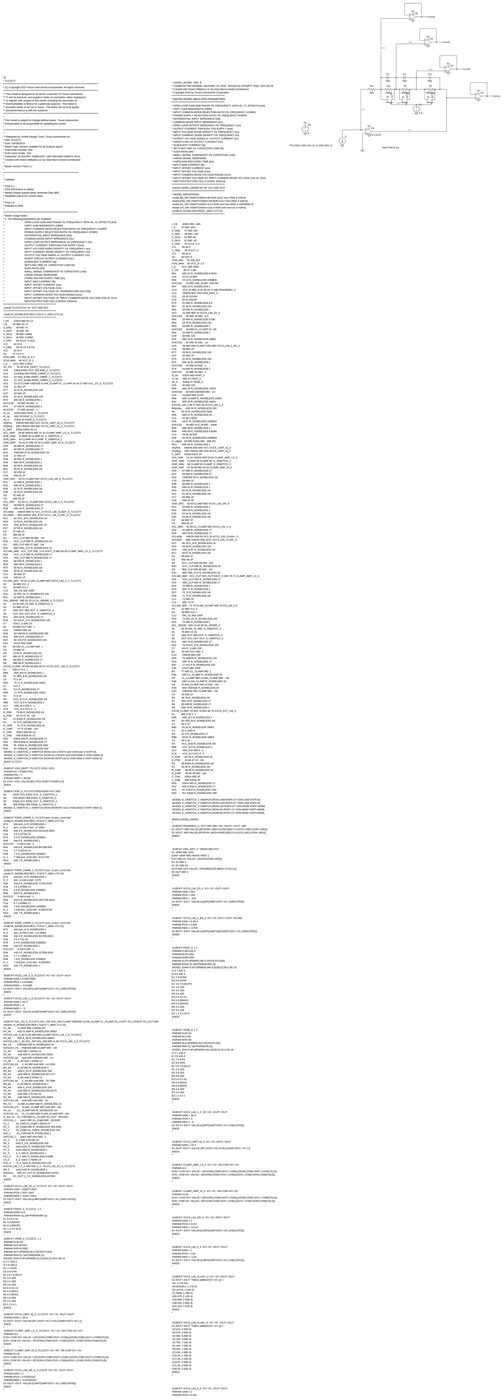
[diagram p0: schematic TIA base.asc, whole sheet]
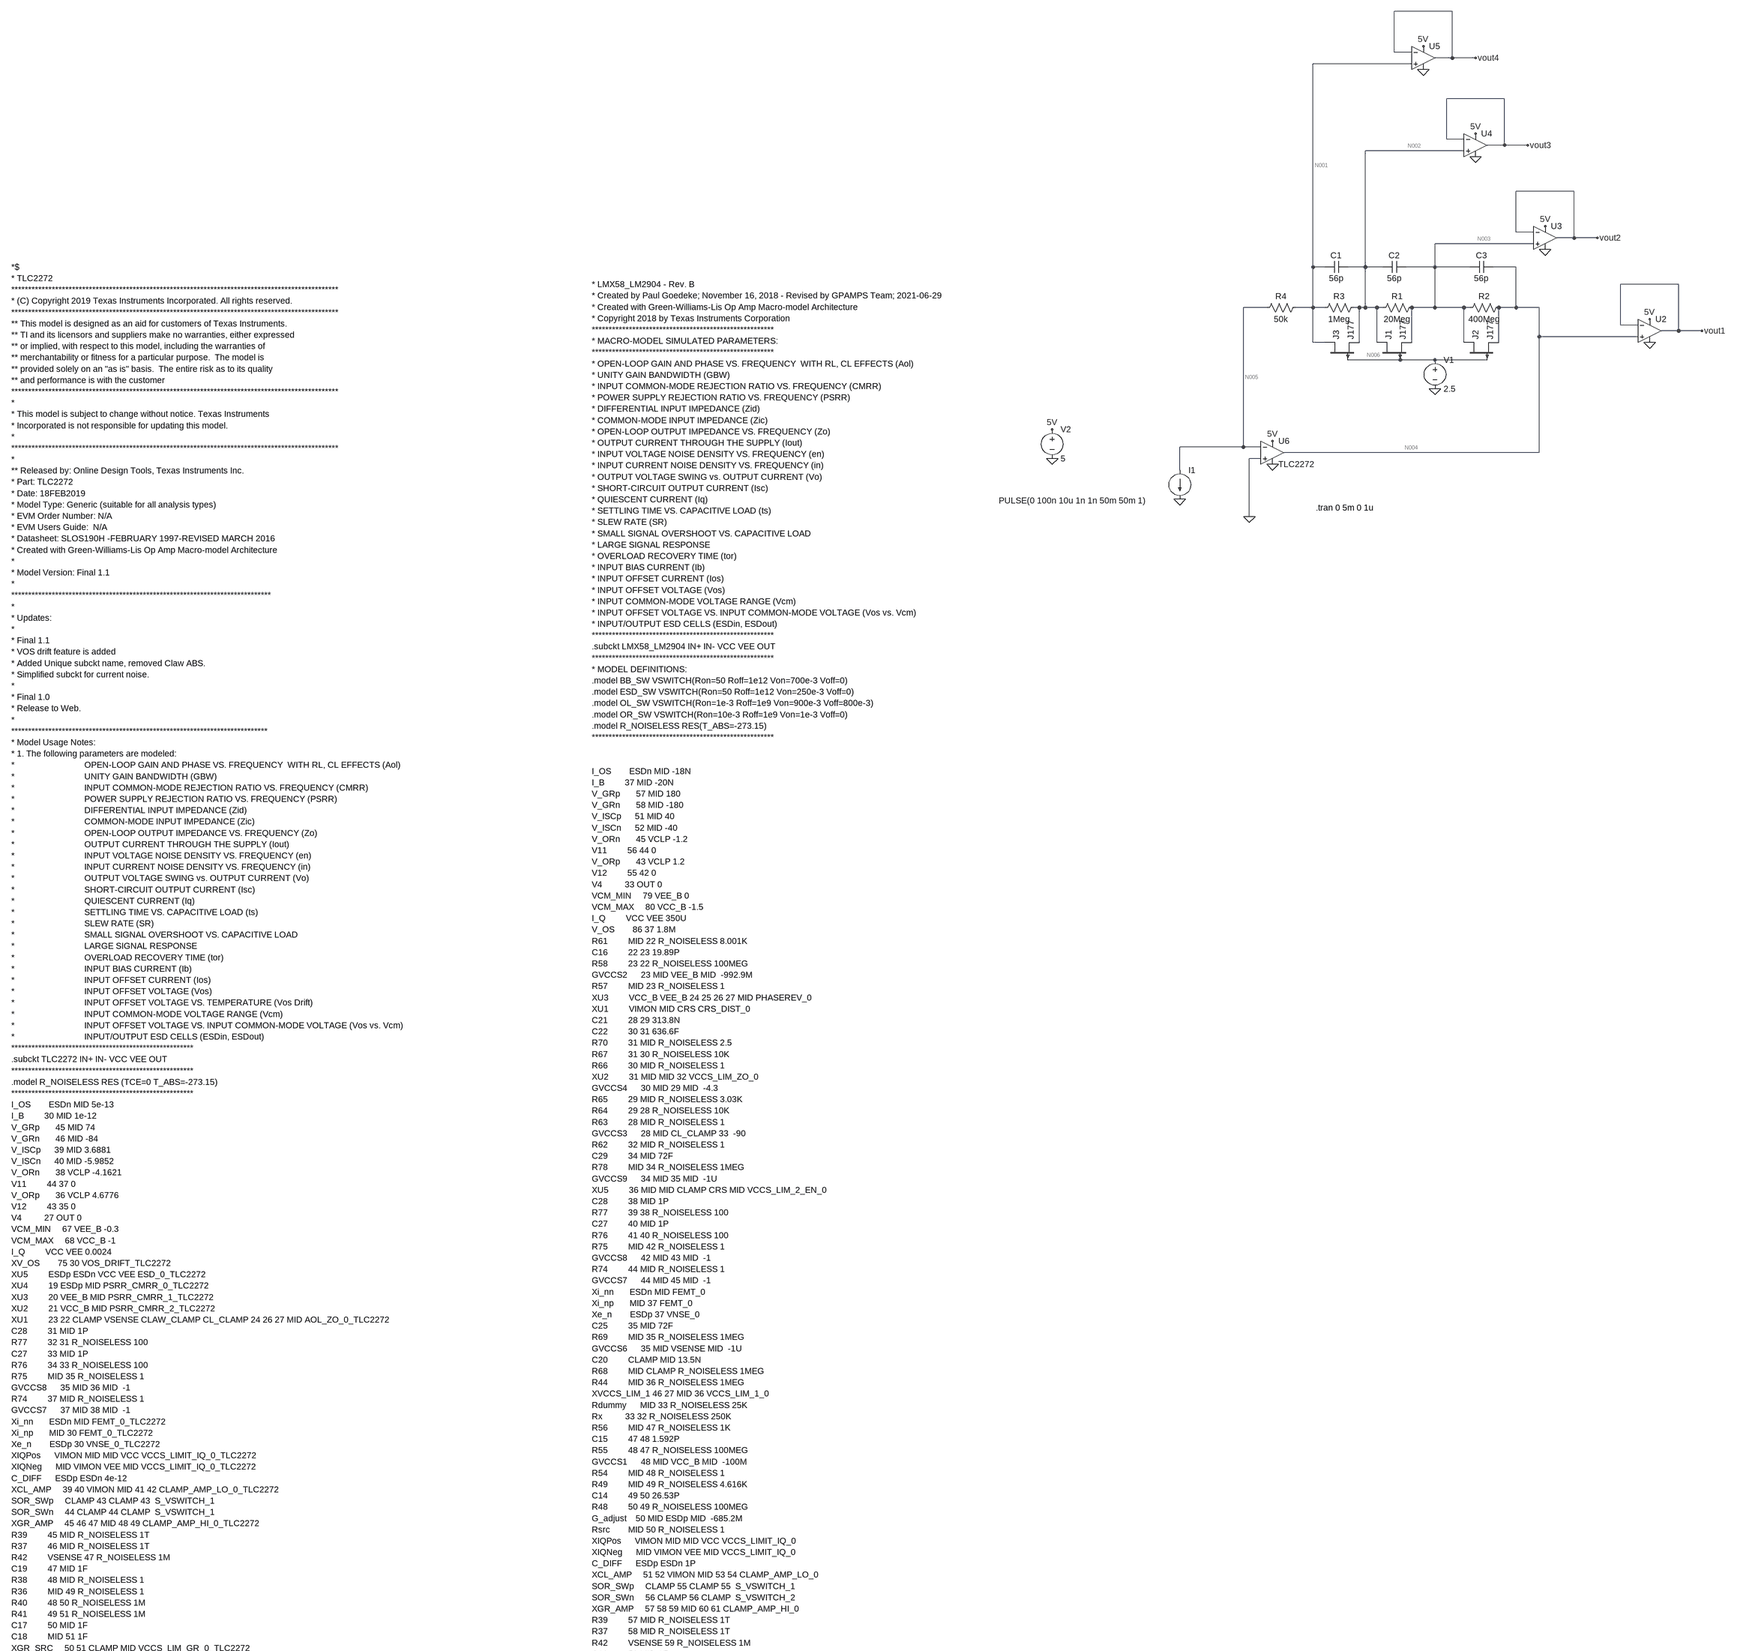
[diagram p1: schematic TIA base.asc, part, row 1 of 3, column 1 of 1]
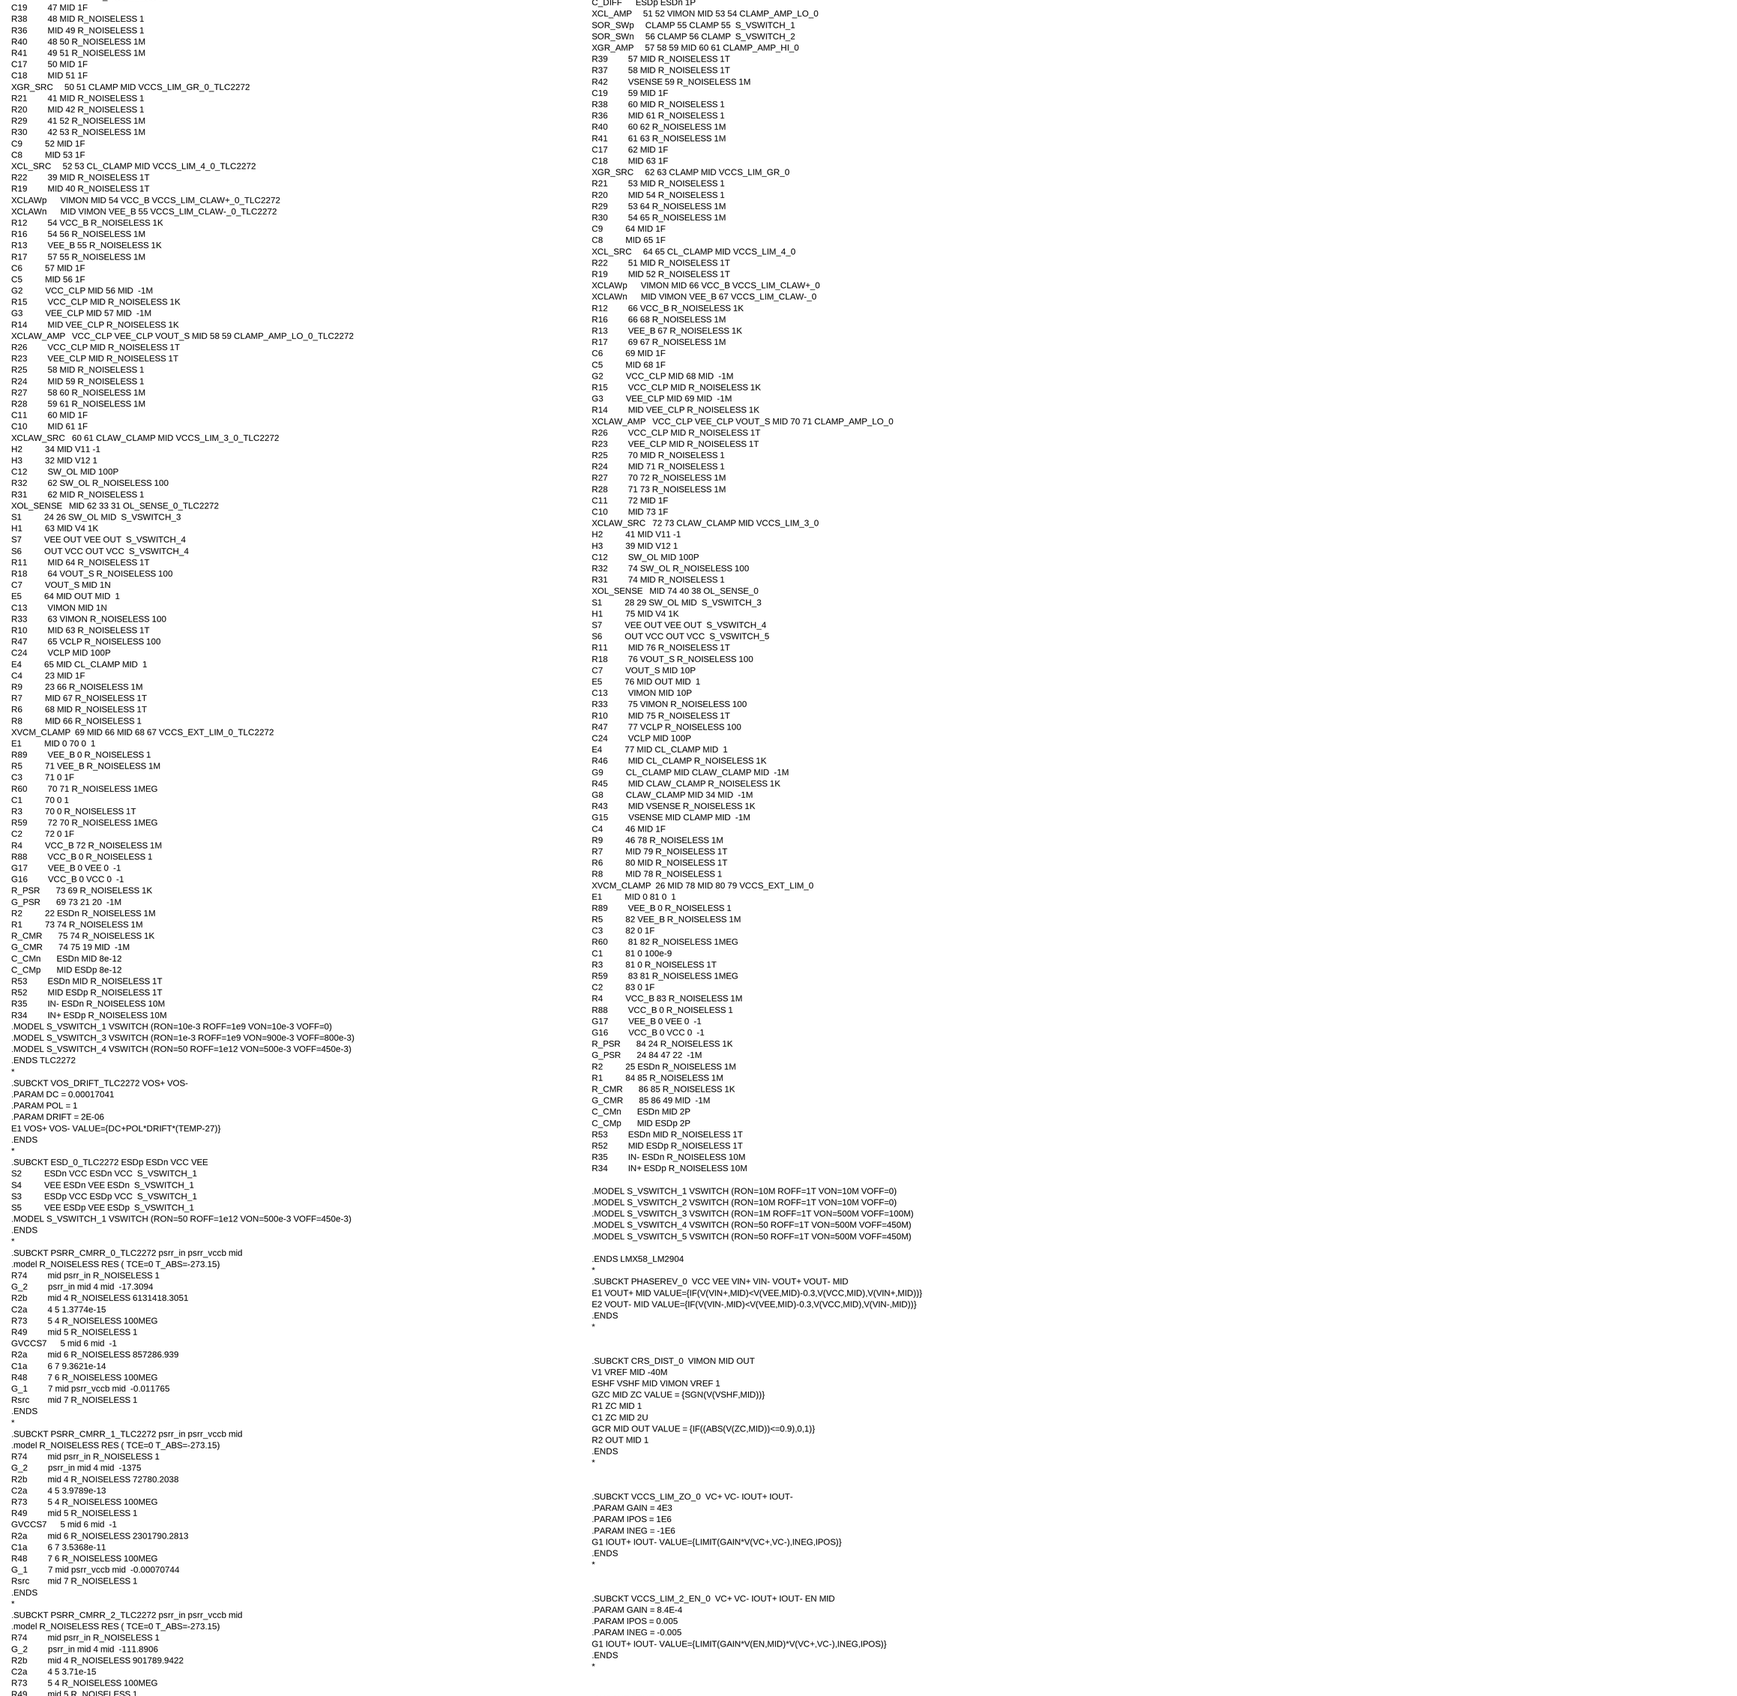
[diagram p2: schematic TIA base.asc, part, row 2 of 3, column 1 of 1]
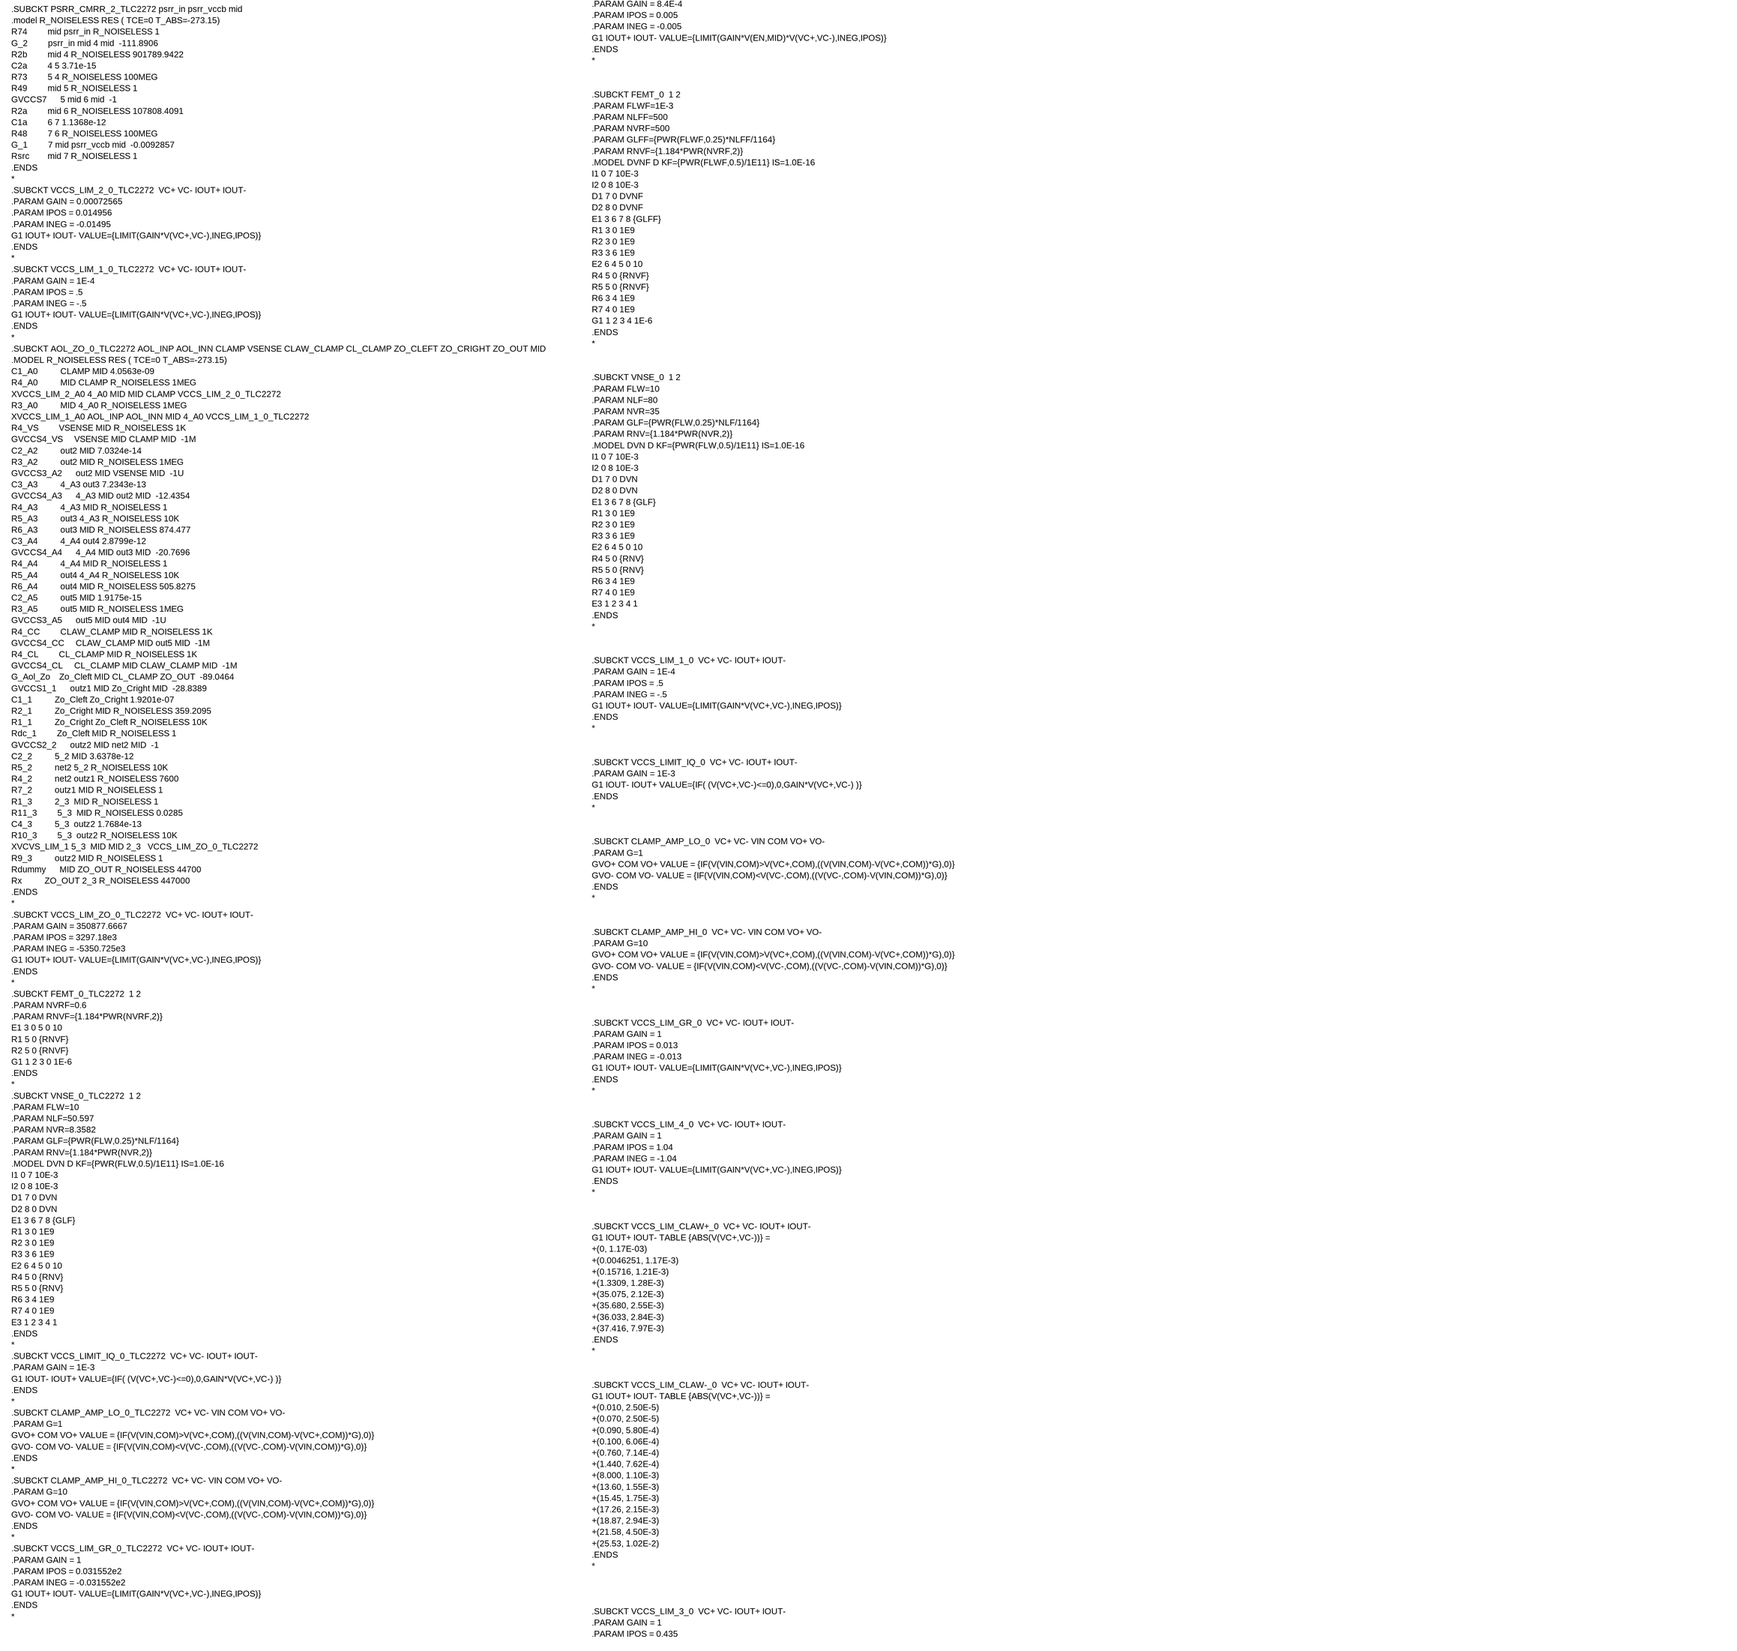
[diagram p3: schematic TIA base.asc, part, row 3 of 3, column 1 of 1]
* TIA base.asc
I1 N005 0 PULSE(0 100n 10u 1n 1n 50m 50m 1)
V2 5V 0 5
R1 N003 N002 20Meg
R2 N004 N003 400Meg
J1 N002 N006 N003 J177
J2 N003 N006 N004 J177
R3 N002 N001 1Meg
V1 N006 0 2.5
J3 N001 N006 N002 J177
R4 N001 N005 50k
X§U2 N004 vout1 5V 0 vout1 level1 Avol=1Meg GBW=10Meg Vos=0 En=0 Enk=0 In=0 Ink=0 Rin=5000Meg  ; pins In+ In- V+ V- OUT
X§U3 N003 vout2 5V 0 vout2 level1 Avol=1Meg GBW=10Meg Vos=0 En=0 Enk=0 In=0 Ink=0 Rin=5000Meg  ; pins In+ In- V+ V- OUT
X§U4 N002 vout3 5V 0 vout3 level1 Avol=1Meg GBW=10Meg Vos=0 En=0 Enk=0 In=0 Ink=0 Rin=5000Meg  ; pins In+ In- V+ V- OUT
X§U5 N001 vout4 5V 0 vout4 level1 Avol=1Meg GBW=10Meg Vos=0 En=0 Enk=0 In=0 Ink=0 Rin=500Meg  ; pins In+ In- V+ V- OUT
C1 N002 N001 56p
C2 N003 N002 56p
C3 N004 N003 56p
X§U6 0 N005 5V 0 N004 TLC2272  ; pins In+ In- V+ V- OUT
.model NJF NJF
.model PJF PJF
.lib standard.jft
* LMX58_LM2904 - Rev. B
* Created by Paul Goedeke; November 16, 2018 - Revised by GPAMPS Team; 2021-06-29
* Created with Green-Williams-Lis Op Amp Macro-model Architecture
* Copyright 2018 by Texas Instruments Corporation
******************************************************
* MACRO-MODEL SIMULATED PARAMETERS:
******************************************************
* OPEN-LOOP GAIN AND PHASE VS. FREQUENCY  WITH RL, CL EFFECTS (Aol)
* UNITY GAIN BANDWIDTH (GBW)
* INPUT COMMON-MODE REJECTION RATIO VS. FREQUENCY (CMRR)
* POWER SUPPLY REJECTION RATIO VS. FREQUENCY (PSRR)
* DIFFERENTIAL INPUT IMPEDANCE (Zid)
* COMMON-MODE INPUT IMPEDANCE (Zic)
* OPEN-LOOP OUTPUT IMPEDANCE VS. FREQUENCY (Zo)
* OUTPUT CURRENT THROUGH THE SUPPLY (Iout)
* INPUT VOLTAGE NOISE DENSITY VS. FREQUENCY (en)
* INPUT CURRENT NOISE DENSITY VS. FREQUENCY (in)
* OUTPUT VOLTAGE SWING vs. OUTPUT CURRENT (Vo)
* SHORT-CIRCUIT OUTPUT CURRENT (Isc)
* QUIESCENT CURRENT (Iq)
* SETTLING TIME VS. CAPACITIVE LOAD (ts)
* SLEW RATE (SR)
* SMALL SIGNAL OVERSHOOT VS. CAPACITIVE LOAD
* LARGE SIGNAL RESPONSE
* OVERLOAD RECOVERY TIME (tor)
* INPUT BIAS CURRENT (Ib)
* INPUT OFFSET CURRENT (Ios)
* INPUT OFFSET VOLTAGE (Vos)
* INPUT COMMON-MODE VOLTAGE RANGE (Vcm)
* INPUT OFFSET VOLTAGE VS. INPUT COMMON-MODE VOLTAGE (Vos vs. Vcm)
* INPUT/OUTPUT ESD CELLS (ESDin, ESDout)
******************************************************
.subckt LMX58_LM2904 IN+ IN- VCC VEE OUT
******************************************************
* MODEL DEFINITIONS:
.model BB_SW VSWITCH(Ron=50 Roff=1e12 Von=700e-3 Voff=0)
.model ESD_SW VSWITCH(Ron=50 Roff=1e12 Von=250e-3 Voff=0)
.model OL_SW VSWITCH(Ron=1e-3 Roff=1e9 Von=900e-3 Voff=800e-3)
.model OR_SW VSWITCH(Ron=10e-3 Roff=1e9 Von=1e-3 Voff=0)
.model R_NOISELESS RES(T_ABS=-273.15)
******************************************************
I_OS        ESDn MID -18N
I_B         37 MID -20N
V_GRp       57 MID 180
V_GRn       58 MID -180
V_ISCp      51 MID 40
V_ISCn      52 MID -40
V_ORn       45 VCLP -1.2
V11         56 44 0
V_ORp       43 VCLP 1.2
V12         55 42 0
V4          33 OUT 0
VCM_MIN     79 VEE_B 0
VCM_MAX     80 VCC_B -1.5
I_Q         VCC VEE 350U
V_OS        86 37 1.8M
R61         MID 22 R_NOISELESS 8.001K
C16         22 23 19.89P
R58         23 22 R_NOISELESS 100MEG
GVCCS2      23 MID VEE_B MID  -992.9M
R57         MID 23 R_NOISELESS 1
XU3         VCC_B VEE_B 24 25 26 27 MID PHASEREV_0
XU1         VIMON MID CRS CRS_DIST_0
C21         28 29 313.8N
C22         30 31 636.6F
R70         31 MID R_NOISELESS 2.5
R67         31 30 R_NOISELESS 10K
R66         30 MID R_NOISELESS 1
XU2         31 MID MID 32 VCCS_LIM_ZO_0
GVCCS4      30 MID 29 MID  -4.3
R65         29 MID R_NOISELESS 3.03K
R64         29 28 R_NOISELESS 10K
R63         28 MID R_NOISELESS 1
GVCCS3      28 MID CL_CLAMP 33  -90
R62         32 MID R_NOISELESS 1
C29         34 MID 72F
R78         MID 34 R_NOISELESS 1MEG
GVCCS9      34 MID 35 MID  -1U
XU5         36 MID MID CLAMP CRS MID VCCS_LIM_2_EN_0
C28         38 MID 1P
R77         39 38 R_NOISELESS 100
C27         40 MID 1P
R76         41 40 R_NOISELESS 100
R75         MID 42 R_NOISELESS 1
GVCCS8      42 MID 43 MID  -1
R74         44 MID R_NOISELESS 1
GVCCS7      44 MID 45 MID  -1
Xi_nn       ESDn MID FEMT_0
Xi_np       MID 37 FEMT_0
Xe_n        ESDp 37 VNSE_0
C25         35 MID 72F
R69         MID 35 R_NOISELESS 1MEG
GVCCS6      35 MID VSENSE MID  -1U
C20         CLAMP MID 13.5N
R68         MID CLAMP R_NOISELESS 1MEG
R44         MID 36 R_NOISELESS 1MEG
XVCCS_LIM_1 46 27 MID 36 VCCS_LIM_1_0
Rdummy      MID 33 R_NOISELESS 25K
Rx          33 32 R_NOISELESS 250K
R56         MID 47 R_NOISELESS 1K
C15         47 48 1.592P
R55         48 47 R_NOISELESS 100MEG
GVCCS1      48 MID VCC_B MID  -100M
R54         MID 48 R_NOISELESS 1
R49         MID 49 R_NOISELESS 4.616K
C14         49 50 26.53P
R48         50 49 R_NOISELESS 100MEG
G_adjust    50 MID ESDp MID  -685.2M
Rsrc        MID 50 R_NOISELESS 1
XIQPos      VIMON MID MID VCC VCCS_LIMIT_IQ_0
XIQNeg      MID VIMON VEE MID VCCS_LIMIT_IQ_0
C_DIFF      ESDp ESDn 1P
XCL_AMP     51 52 VIMON MID 53 54 CLAMP_AMP_LO_0
SOR_SWp     CLAMP 55 CLAMP 55  S_VSWITCH_1
SOR_SWn     56 CLAMP 56 CLAMP  S_VSWITCH_2
XGR_AMP     57 58 59 MID 60 61 CLAMP_AMP_HI_0
R39         57 MID R_NOISELESS 1T
R37         58 MID R_NOISELESS 1T
R42         VSENSE 59 R_NOISELESS 1M
C19         59 MID 1F
R38         60 MID R_NOISELESS 1
R36         MID 61 R_NOISELESS 1
R40         60 62 R_NOISELESS 1M
R41         61 63 R_NOISELESS 1M
C17         62 MID 1F
C18         MID 63 1F
XGR_SRC     62 63 CLAMP MID VCCS_LIM_GR_0
R21         53 MID R_NOISELESS 1
R20         MID 54 R_NOISELESS 1
R29         53 64 R_NOISELESS 1M
R30         54 65 R_NOISELESS 1M
C9          64 MID 1F
C8          MID 65 1F
XCL_SRC     64 65 CL_CLAMP MID VCCS_LIM_4_0
R22         51 MID R_NOISELESS 1T
R19         MID 52 R_NOISELESS 1T
XCLAWp      VIMON MID 66 VCC_B VCCS_LIM_CLAW+_0
XCLAWn      MID VIMON VEE_B 67 VCCS_LIM_CLAW-_0
R12         66 VCC_B R_NOISELESS 1K
R16         66 68 R_NOISELESS 1M
R13         VEE_B 67 R_NOISELESS 1K
R17         69 67 R_NOISELESS 1M
C6          69 MID 1F
C5          MID 68 1F
G2          VCC_CLP MID 68 MID  -1M
R15         VCC_CLP MID R_NOISELESS 1K
G3          VEE_CLP MID 69 MID  -1M
R14         MID VEE_CLP R_NOISELESS 1K
XCLAW_AMP   VCC_CLP VEE_CLP VOUT_S MID 70 71 CLAMP_AMP_LO_0
R26         VCC_CLP MID R_NOISELESS 1T
R23         VEE_CLP MID R_NOISELESS 1T
R25         70 MID R_NOISELESS 1
R24         MID 71 R_NOISELESS 1
R27         70 72 R_NOISELESS 1M
R28         71 73 R_NOISELESS 1M
C11         72 MID 1F
C10         MID 73 1F
XCLAW_SRC   72 73 CLAW_CLAMP MID VCCS_LIM_3_0
H2          41 MID V11 -1
H3          39 MID V12 1
C12         SW_OL MID 100P
R32         74 SW_OL R_NOISELESS 100
R31         74 MID R_NOISELESS 1
XOL_SENSE   MID 74 40 38 OL_SENSE_0
S1          28 29 SW_OL MID  S_VSWITCH_3
H1          75 MID V4 1K
S7          VEE OUT VEE OUT  S_VSWITCH_4
S6          OUT VCC OUT VCC  S_VSWITCH_5
R11         MID 76 R_NOISELESS 1T
R18         76 VOUT_S R_NOISELESS 100
C7          VOUT_S MID 10P
E5          76 MID OUT MID  1
C13         VIMON MID 10P
R33         75 VIMON R_NOISELESS 100
R10         MID 75 R_NOISELESS 1T
R47         77 VCLP R_NOISELESS 100
C24         VCLP MID 100P
E4          77 MID CL_CLAMP MID  1
R46         MID CL_CLAMP R_NOISELESS 1K
G9          CL_CLAMP MID CLAW_CLAMP MID  -1M
R45         MID CLAW_CLAMP R_NOISELESS 1K
G8          CLAW_CLAMP MID 34 MID  -1M
R43         MID VSENSE R_NOISELESS 1K
G15         VSENSE MID CLAMP MID  -1M
C4          46 MID 1F
R9          46 78 R_NOISELESS 1M
R7          MID 79 R_NOISELESS 1T
R6          80 MID R_NOISELESS 1T
R8          MID 78 R_NOISELESS 1
XVCM_CLAMP  26 MID 78 MID 80 79 VCCS_EXT_LIM_0
E1          MID 0 81 0  1
R89         VEE_B 0 R_NOISELESS 1
R5          82 VEE_B R_NOISELESS 1M
C3          82 0 1F
R60         81 82 R_NOISELESS 1MEG
C1          81 0 100e-9
R3          81 0 R_NOISELESS 1T
R59         83 81 R_NOISELESS 1MEG
C2          83 0 1F
R4          VCC_B 83 R_NOISELESS 1M
R88         VCC_B 0 R_NOISELESS 1
G17         VEE_B 0 VEE 0  -1
G16         VCC_B 0 VCC 0  -1
R_PSR       84 24 R_NOISELESS 1K
G_PSR       24 84 47 22  -1M
R2          25 ESDn R_NOISELESS 1M
R1          84 85 R_NOISELESS 1M
R_CMR       86 85 R_NOISELESS 1K
G_CMR       85 86 49 MID  -1M
C_CMn       ESDn MID 2P
C_CMp       MID ESDp 2P
R53         ESDn MID R_NOISELESS 1T
R52         MID ESDp R_NOISELESS 1T
R35         IN- ESDn R_NOISELESS 10M
R34         IN+ ESDp R_NOISELESS 10M
.MODEL S_VSWITCH_1 VSWITCH (RON=10M ROFF=1T VON=10M VOFF=0)
.MODEL S_VSWITCH_2 VSWITCH (RON=10M ROFF=1T VON=10M VOFF=0)
.MODEL S_VSWITCH_3 VSWITCH (RON=1M ROFF=1T VON=500M VOFF=100M)
.MODEL S_VSWITCH_4 VSWITCH (RON=50 ROFF=1T VON=500M VOFF=450M)
.MODEL S_VSWITCH_5 VSWITCH (RON=50 ROFF=1T VON=500M VOFF=450M)
.ENDS LMX58_LM2904
*
.SUBCKT PHASEREV_0  VCC VEE VIN+ VIN- VOUT+ VOUT- MID
E1 VOUT+ MID VALUE={IF(V(VIN+,MID)<V(VEE,MID)-0.3,V(VCC,MID),V(VIN+,MID))}
E2 VOUT- MID VALUE={IF(V(VIN-,MID)<V(VEE,MID)-0.3,V(VCC,MID),V(VIN-,MID))}
.ENDS
*
.SUBCKT CRS_DIST_0  VIMON MID OUT
V1 VREF MID -40M
ESHF VSHF MID VIMON VREF 1
GZC MID ZC VALUE = {SGN(V(VSHF,MID))}
R1 ZC MID 1
C1 ZC MID 2U
GCR MID OUT VALUE = {IF((ABS(V(ZC,MID))<=0.9),0,1)}
R2 OUT MID 1
.ENDS
*
.SUBCKT VCCS_LIM_ZO_0  VC+ VC- IOUT+ IOUT-
.PARAM GAIN = 4E3
.PARAM IPOS = 1E6
.PARAM INEG = -1E6
G1 IOUT+ IOUT- VALUE={LIMIT(GAIN*V(VC+,VC-),INEG,IPOS)}
.ENDS
*
.SUBCKT VCCS_LIM_2_EN_0  VC+ VC- IOUT+ IOUT- EN MID
.PARAM GAIN = 8.4E-4
.PARAM IPOS = 0.005
.PARAM INEG = -0.005
G1 IOUT+ IOUT- VALUE={LIMIT(GAIN*V(EN,MID)*V(VC+,VC-),INEG,IPOS)}
.ENDS
*
.SUBCKT FEMT_0  1 2
.PARAM FLWF=1E-3
.PARAM NLFF=500
.PARAM NVRF=500
.PARAM GLFF={PWR(FLWF,0.25)*NLFF/1164}
.PARAM RNVF={1.184*PWR(NVRF,2)}
.MODEL DVNF D KF={PWR(FLWF,0.5)/1E11} IS=1.0E-16
I1 0 7 10E-3
I2 0 8 10E-3
D1 7 0 DVNF
D2 8 0 DVNF
E1 3 6 7 8 {GLFF}
R1 3 0 1E9
R2 3 0 1E9
R3 3 6 1E9
E2 6 4 5 0 10
R4 5 0 {RNVF}
R5 5 0 {RNVF}
R6 3 4 1E9
R7 4 0 1E9
G1 1 2 3 4 1E-6
.ENDS
*
.SUBCKT VNSE_0  1 2
.PARAM FLW=10
.PARAM NLF=80
.PARAM NVR=35
.PARAM GLF={PWR(FLW,0.25)*NLF/1164}
.PARAM RNV={1.184*PWR(NVR,2)}
.MODEL DVN D KF={PWR(FLW,0.5)/1E11} IS=1.0E-16
I1 0 7 10E-3
I2 0 8 10E-3
D1 7 0 DVN
D2 8 0 DVN
E1 3 6 7 8 {GLF}
R1 3 0 1E9
R2 3 0 1E9
R3 3 6 1E9
E2 6 4 5 0 10
R4 5 0 {RNV}
R5 5 0 {RNV}
R6 3 4 1E9
R7 4 0 1E9
E3 1 2 3 4 1
.ENDS
*
.SUBCKT VCCS_LIM_1_0  VC+ VC- IOUT+ IOUT-
.PARAM GAIN = 1E-4
.PARAM IPOS = .5
.PARAM INEG = -.5
G1 IOUT+ IOUT- VALUE={LIMIT(GAIN*V(VC+,VC-),INEG,IPOS)}
.ENDS
*
.SUBCKT VCCS_LIMIT_IQ_0  VC+ VC- IOUT+ IOUT-
.PARAM GAIN = 1E-3
G1 IOUT- IOUT+ VALUE={IF( (V(VC+,VC-)<=0),0,GAIN*V(VC+,VC-) )}
.ENDS
*
.SUBCKT CLAMP_AMP_LO_0  VC+ VC- VIN COM VO+ VO-
.PARAM G=1
GVO+ COM VO+ VALUE = {IF(V(VIN,COM)>V(VC+,COM),((V(VIN,COM)-V(VC+,COM))*G),0)}
GVO- COM VO- VALUE = {IF(V(VIN,COM)<V(VC-,COM),((V(VC-,COM)-V(VIN,COM))*G),0)}
.ENDS
*
.SUBCKT CLAMP_AMP_HI_0  VC+ VC- VIN COM VO+ VO-
.PARAM G=10
GVO+ COM VO+ VALUE = {IF(V(VIN,COM)>V(VC+,COM),((V(VIN,COM)-V(VC+,COM))*G),0)}
GVO- COM VO- VALUE = {IF(V(VIN,COM)<V(VC-,COM),((V(VC-,COM)-V(VIN,COM))*G),0)}
.ENDS
*
.SUBCKT VCCS_LIM_GR_0  VC+ VC- IOUT+ IOUT-
.PARAM GAIN = 1
.PARAM IPOS = 0.013
.PARAM INEG = -0.013
G1 IOUT+ IOUT- VALUE={LIMIT(GAIN*V(VC+,VC-),INEG,IPOS)}
.ENDS
*
.SUBCKT VCCS_LIM_4_0  VC+ VC- IOUT+ IOUT-
.PARAM GAIN = 1
.PARAM IPOS = 1.04
.PARAM INEG = -1.04
G1 IOUT+ IOUT- VALUE={LIMIT(GAIN*V(VC+,VC-),INEG,IPOS)}
.ENDS
*
.SUBCKT VCCS_LIM_CLAW+_0  VC+ VC- IOUT+ IOUT-
G1 IOUT+ IOUT- TABLE {ABS(V(VC+,VC-))} =
+(0, 1.17E-03)
+(0.0046251, 1.17E-3)
+(0.15716, 1.21E-3)
+(1.3309, 1.28E-3)
+(35.075, 2.12E-3)
+(35.680, 2.55E-3)
+(36.033, 2.84E-3)
+(37.416, 7.97E-3)
.ENDS
*
.SUBCKT VCCS_LIM_CLAW-_0  VC+ VC- IOUT+ IOUT-
G1 IOUT+ IOUT- TABLE {ABS(V(VC+,VC-))} =
+(0.010, 2.50E-5)
+(0.070, 2.50E-5)
+(0.090, 5.80E-4)
+(0.100, 6.06E-4)
+(0.760, 7.14E-4)
+(1.440, 7.62E-4)
+(8.000, 1.10E-3)
+(13.60, 1.55E-3)
+(15.45, 1.75E-3)
+(17.26, 2.15E-3)
+(18.87, 2.94E-3)
+(21.58, 4.50E-3)
+(25.53, 1.02E-2)
.ENDS
*
.SUBCKT VCCS_LIM_3_0  VC+ VC- IOUT+ IOUT-
.PARAM GAIN = 1
.PARAM IPOS = 0.435
.PARAM INEG = -0.435
G1 IOUT+ IOUT- VALUE={LIMIT(GAIN*V(VC+,VC-),INEG,IPOS)}
.ENDS
*
.SUBCKT OL_SENSE_0  COM SW+ OLN  OLP
GSW+ COM SW+ VALUE = {IF((V(OLN,COM)>10E-3 | V(OLP,COM)>10E-3),1,0)}
.ENDS
*
.SUBCKT VCCS_EXT_LIM_0  VIN+ VIN- IOUT- IOUT+ VP+ VP-
.PARAM GAIN = 1
G1 IOUT+ IOUT- VALUE={LIMIT(GAIN*V(VIN+,VIN-),V(VP-,VIN-), V(VP+,VIN-))}
.ENDS
*
.tran 0 5m 0 1u
*$
* TLC2272
*************************************************************************************************
* (C) Copyright 2019 Texas Instruments Incorporated. All rights reserved.
*************************************************************************************************
** This model is designed as an aid for customers of Texas Instruments.
** TI and its licensors and suppliers make no warranties, either expressed
** or implied, with respect to this model, including the warranties of
** merchantability or fitness for a particular purpose.  The model is
** provided solely on an "as is" basis.  The entire risk as to its quality
** and performance is with the customer
*************************************************************************************************
*
* This model is subject to change without notice. Texas Instruments
* Incorporated is not responsible for updating this model.
*
*************************************************************************************************
*
** Released by: Online Design Tools, Texas Instruments Inc.
* Part: TLC2272
* Date: 18FEB2019
* Model Type: Generic (suitable for all analysis types)
* EVM Order Number: N/A
* EVM Users Guide:  N/A
* Datasheet: SLOS190H -FEBRUARY 1997-REVISED MARCH 2016
* Created with Green-Williams-Lis Op Amp Macro-model Architecture
*
* Model Version: Final 1.1
*
*****************************************************************************
*
* Updates:
*
* Final 1.1
* VOS drift feature is added
* Added Unique subckt name, removed Claw ABS.
* Simplified subckt for current noise.
*
* Final 1.0
* Release to Web.
*
****************************************************************************
* Model Usage Notes:
* 1. The following parameters are modeled:
*                               OPEN-LOOP GAIN AND PHASE VS. FREQUENCY  WITH RL, CL EFFECTS (Aol)
*                               UNITY GAIN BANDWIDTH (GBW)
*                               INPUT COMMON-MODE REJECTION RATIO VS. FREQUENCY (CMRR)
*                               POWER SUPPLY REJECTION RATIO VS. FREQUENCY (PSRR)
*                               DIFFERENTIAL INPUT IMPEDANCE (Zid)
*                               COMMON-MODE INPUT IMPEDANCE (Zic)
*                               OPEN-LOOP OUTPUT IMPEDANCE VS. FREQUENCY (Zo)
*                               OUTPUT CURRENT THROUGH THE SUPPLY (Iout)
*                               INPUT VOLTAGE NOISE DENSITY VS. FREQUENCY (en)
*                               INPUT CURRENT NOISE DENSITY VS. FREQUENCY (in)
*                               OUTPUT VOLTAGE SWING vs. OUTPUT CURRENT (Vo)
*                               SHORT-CIRCUIT OUTPUT CURRENT (Isc)
*                               QUIESCENT CURRENT (Iq)
*                               SETTLING TIME VS. CAPACITIVE LOAD (ts)
*                               SLEW RATE (SR)
*                               SMALL SIGNAL OVERSHOOT VS. CAPACITIVE LOAD
*                               LARGE SIGNAL RESPONSE
*                               OVERLOAD RECOVERY TIME (tor)
*                               INPUT BIAS CURRENT (Ib)
*                               INPUT OFFSET CURRENT (Ios)
*                               INPUT OFFSET VOLTAGE (Vos)
*                               INPUT OFFSET VOLTAGE VS. TEMPERATURE (Vos Drift)
*                               INPUT COMMON-MODE VOLTAGE RANGE (Vcm)
*                               INPUT OFFSET VOLTAGE VS. INPUT COMMON-MODE VOLTAGE (Vos vs. Vcm)
*                               INPUT/OUTPUT ESD CELLS (ESDin, ESDout)
******************************************************
.subckt TLC2272 IN+ IN- VCC VEE OUT
******************************************************
.model R_NOISELESS RES (TCE=0 T_ABS=-273.15)
******************************************************
I_OS        ESDn MID 5e-13
I_B         30 MID 1e-12
V_GRp       45 MID 74
V_GRn       46 MID -84
V_ISCp      39 MID 3.6881
V_ISCn      40 MID -5.9852
V_ORn       38 VCLP -4.1621
V11         44 37 0
V_ORp       36 VCLP 4.6776
V12         43 35 0
V4          27 OUT 0
VCM_MIN     67 VEE_B -0.3
VCM_MAX     68 VCC_B -1
I_Q         VCC VEE 0.0024
XV_OS        75 30 VOS_DRIFT_TLC2272
XU5         ESDp ESDn VCC VEE ESD_0_TLC2272
XU4         19 ESDp MID PSRR_CMRR_0_TLC2272
XU3         20 VEE_B MID PSRR_CMRR_1_TLC2272
XU2         21 VCC_B MID PSRR_CMRR_2_TLC2272
XU1         23 22 CLAMP VSENSE CLAW_CLAMP CL_CLAMP 24 26 27 MID AOL_ZO_0_TLC2272
C28         31 MID 1P
R77         32 31 R_NOISELESS 100
C27         33 MID 1P
R76         34 33 R_NOISELESS 100
R75         MID 35 R_NOISELESS 1
GVCCS8      35 MID 36 MID  -1
R74         37 MID R_NOISELESS 1
GVCCS7      37 MID 38 MID  -1
Xi_nn       ESDn MID FEMT_0_TLC2272
Xi_np       MID 30 FEMT_0_TLC2272
Xe_n        ESDp 30 VNSE_0_TLC2272
XIQPos      VIMON MID MID VCC VCCS_LIMIT_IQ_0_TLC2272
XIQNeg      MID VIMON VEE MID VCCS_LIMIT_IQ_0_TLC2272
C_DIFF      ESDp ESDn 4e-12
XCL_AMP     39 40 VIMON MID 41 42 CLAMP_AMP_LO_0_TLC2272
SOR_SWp     CLAMP 43 CLAMP 43  S_VSWITCH_1
SOR_SWn     44 CLAMP 44 CLAMP  S_VSWITCH_1
XGR_AMP     45 46 47 MID 48 49 CLAMP_AMP_HI_0_TLC2272
R39         45 MID R_NOISELESS 1T
R37         46 MID R_NOISELESS 1T
R42         VSENSE 47 R_NOISELESS 1M
C19         47 MID 1F
R38         48 MID R_NOISELESS 1
R36         MID 49 R_NOISELESS 1
R40         48 50 R_NOISELESS 1M
R41         49 51 R_NOISELESS 1M
C17         50 MID 1F
C18         MID 51 1F
XGR_SRC     50 51 CLAMP MID VCCS_LIM_GR_0_TLC2272
R21         41 MID R_NOISELESS 1
R20         MID 42 R_NOISELESS 1
R29         41 52 R_NOISELESS 1M
R30         42 53 R_NOISELESS 1M
C9          52 MID 1F
C8          MID 53 1F
XCL_SRC     52 53 CL_CLAMP MID VCCS_LIM_4_0_TLC2272
R22         39 MID R_NOISELESS 1T
R19         MID 40 R_NOISELESS 1T
XCLAWp      VIMON MID 54 VCC_B VCCS_LIM_CLAW+_0_TLC2272
XCLAWn      MID VIMON VEE_B 55 VCCS_LIM_CLAW-_0_TLC2272
R12         54 VCC_B R_NOISELESS 1K
R16         54 56 R_NOISELESS 1M
R13         VEE_B 55 R_NOISELESS 1K
R17         57 55 R_NOISELESS 1M
C6          57 MID 1F
C5          MID 56 1F
G2          VCC_CLP MID 56 MID  -1M
R15         VCC_CLP MID R_NOISELESS 1K
G3          VEE_CLP MID 57 MID  -1M
R14         MID VEE_CLP R_NOISELESS 1K
XCLAW_AMP   VCC_CLP VEE_CLP VOUT_S MID 58 59 CLAMP_AMP_LO_0_TLC2272
R26         VCC_CLP MID R_NOISELESS 1T
R23         VEE_CLP MID R_NOISELESS 1T
R25         58 MID R_NOISELESS 1
R24         MID 59 R_NOISELESS 1
R27         58 60 R_NOISELESS 1M
R28         59 61 R_NOISELESS 1M
C11         60 MID 1F
C10         MID 61 1F
XCLAW_SRC   60 61 CLAW_CLAMP MID VCCS_LIM_3_0_TLC2272
H2          34 MID V11 -1
H3          32 MID V12 1
C12         SW_OL MID 100P
R32         62 SW_OL R_NOISELESS 100
R31         62 MID R_NOISELESS 1
XOL_SENSE   MID 62 33 31 OL_SENSE_0_TLC2272
S1          24 26 SW_OL MID  S_VSWITCH_3
H1          63 MID V4 1K
S7          VEE OUT VEE OUT  S_VSWITCH_4
S6          OUT VCC OUT VCC  S_VSWITCH_4
R11         MID 64 R_NOISELESS 1T
R18         64 VOUT_S R_NOISELESS 100
C7          VOUT_S MID 1N
E5          64 MID OUT MID  1
C13         VIMON MID 1N
R33         63 VIMON R_NOISELESS 100
R10         MID 63 R_NOISELESS 1T
R47         65 VCLP R_NOISELESS 100
C24         VCLP MID 100P
E4          65 MID CL_CLAMP MID  1
C4          23 MID 1F
R9          23 66 R_NOISELESS 1M
R7          MID 67 R_NOISELESS 1T
R6          68 MID R_NOISELESS 1T
R8          MID 66 R_NOISELESS 1
XVCM_CLAMP  69 MID 66 MID 68 67 VCCS_EXT_LIM_0_TLC2272
E1          MID 0 70 0  1
R89         VEE_B 0 R_NOISELESS 1
R5          71 VEE_B R_NOISELESS 1M
C3          71 0 1F
R60         70 71 R_NOISELESS 1MEG
C1          70 0 1
R3          70 0 R_NOISELESS 1T
R59         72 70 R_NOISELESS 1MEG
C2          72 0 1F
R4          VCC_B 72 R_NOISELESS 1M
R88         VCC_B 0 R_NOISELESS 1
G17         VEE_B 0 VEE 0  -1
G16         VCC_B 0 VCC 0  -1
R_PSR       73 69 R_NOISELESS 1K
G_PSR       69 73 21 20  -1M
R2          22 ESDn R_NOISELESS 1M
R1          73 74 R_NOISELESS 1M
R_CMR       75 74 R_NOISELESS 1K
G_CMR       74 75 19 MID  -1M
C_CMn       ESDn MID 8e-12
C_CMp       MID ESDp 8e-12
R53         ESDn MID R_NOISELESS 1T
R52         MID ESDp R_NOISELESS 1T
R35         IN- ESDn R_NOISELESS 10M
R34         IN+ ESDp R_NOISELESS 10M
.MODEL S_VSWITCH_1 VSWITCH (RON=10e-3 ROFF=1e9 VON=10e-3 VOFF=0)
.MODEL S_VSWITCH_3 VSWITCH (RON=1e-3 ROFF=1e9 VON=900e-3 VOFF=800e-3)
.MODEL S_VSWITCH_4 VSWITCH (RON=50 ROFF=1e12 VON=500e-3 VOFF=450e-3)
.ENDS TLC2272
*
.SUBCKT VOS_DRIFT_TLC2272 VOS+ VOS-
.PARAM DC = 0.00017041
.PARAM POL = 1
.PARAM DRIFT = 2E-06
E1 VOS+ VOS- VALUE={DC+POL*DRIFT*(TEMP-27)}
.ENDS
*
.SUBCKT ESD_0_TLC2272 ESDp ESDn VCC VEE
S2          ESDn VCC ESDn VCC  S_VSWITCH_1
S4          VEE ESDn VEE ESDn  S_VSWITCH_1
S3          ESDp VCC ESDp VCC  S_VSWITCH_1
S5          VEE ESDp VEE ESDp  S_VSWITCH_1
.MODEL S_VSWITCH_1 VSWITCH (RON=50 ROFF=1e12 VON=500e-3 VOFF=450e-3)
.ENDS
*
.SUBCKT PSRR_CMRR_0_TLC2272 psrr_in psrr_vccb mid
.model R_NOISELESS RES ( TCE=0 T_ABS=-273.15)
R74         mid psrr_in R_NOISELESS 1
G_2         psrr_in mid 4 mid  -17.3094
R2b         mid 4 R_NOISELESS 6131418.3051
C2a         4 5 1.3774e-15
R73         5 4 R_NOISELESS 100MEG
R49         mid 5 R_NOISELESS 1
GVCCS7      5 mid 6 mid  -1
R2a         mid 6 R_NOISELESS 857286.939
C1a         6 7 9.3621e-14
R48         7 6 R_NOISELESS 100MEG
G_1         7 mid psrr_vccb mid  -0.011765
Rsrc        mid 7 R_NOISELESS 1
.ENDS
*
.SUBCKT PSRR_CMRR_1_TLC2272 psrr_in psrr_vccb mid
.model R_NOISELESS RES ( TCE=0 T_ABS=-273.15)
R74         mid psrr_in R_NOISELESS 1
G_2         psrr_in mid 4 mid  -1375
R2b         mid 4 R_NOISELESS 72780.2038
C2a         4 5 3.9789e-13
R73         5 4 R_NOISELESS 100MEG
R49         mid 5 R_NOISELESS 1
GVCCS7      5 mid 6 mid  -1
R2a         mid 6 R_NOISELESS 2301790.2813
C1a         6 7 3.5368e-11
R48         7 6 R_NOISELESS 100MEG
G_1         7 mid psrr_vccb mid  -0.00070744
Rsrc        mid 7 R_NOISELESS 1
.ENDS
*
.SUBCKT PSRR_CMRR_2_TLC2272 psrr_in psrr_vccb mid
.model R_NOISELESS RES ( TCE=0 T_ABS=-273.15)
R74         mid psrr_in R_NOISELESS 1
G_2         psrr_in mid 4 mid  -111.8906
R2b         mid 4 R_NOISELESS 901789.9422
C2a         4 5 3.71e-15
R73         5 4 R_NOISELESS 100MEG
R49         mid 5 R_NOISELESS 1
GVCCS7      5 mid 6 mid  -1
R2a         mid 6 R_NOISELESS 107808.4091
C1a         6 7 1.1368e-12
R48         7 6 R_NOISELESS 100MEG
G_1         7 mid psrr_vccb mid  -0.0092857
Rsrc        mid 7 R_NOISELESS 1
.ENDS
*
.SUBCKT VCCS_LIM_2_0_TLC2272  VC+ VC- IOUT+ IOUT-
.PARAM GAIN = 0.00072565
.PARAM IPOS = 0.014956
.PARAM INEG = -0.01495
G1 IOUT+ IOUT- VALUE={LIMIT(GAIN*V(VC+,VC-),INEG,IPOS)}
.ENDS
*
.SUBCKT VCCS_LIM_1_0_TLC2272  VC+ VC- IOUT+ IOUT-
.PARAM GAIN = 1E-4
.PARAM IPOS = .5
.PARAM INEG = -.5
G1 IOUT+ IOUT- VALUE={LIMIT(GAIN*V(VC+,VC-),INEG,IPOS)}
.ENDS
*
.SUBCKT AOL_ZO_0_TLC2272 AOL_INP AOL_INN CLAMP VSENSE CLAW_CLAMP CL_CLAMP ZO_CLEFT ZO_CRIGHT ZO_OUT MID
.MODEL R_NOISELESS RES ( TCE=0 T_ABS=-273.15)
C1_A0          CLAMP MID 4.0563e-09
R4_A0          MID CLAMP R_NOISELESS 1MEG
XVCCS_LIM_2_A0 4_A0 MID MID CLAMP VCCS_LIM_2_0_TLC2272
R3_A0          MID 4_A0 R_NOISELESS 1MEG
XVCCS_LIM_1_A0 AOL_INP AOL_INN MID 4_A0 VCCS_LIM_1_0_TLC2272
R4_VS         VSENSE MID R_NOISELESS 1K
GVCCS4_VS     VSENSE MID CLAMP MID  -1M
C2_A2          out2 MID 7.0324e-14
R3_A2          out2 MID R_NOISELESS 1MEG
GVCCS3_A2      out2 MID VSENSE MID  -1U
C3_A3          4_A3 out3 7.2343e-13
GVCCS4_A3      4_A3 MID out2 MID  -12.4354
R4_A3          4_A3 MID R_NOISELESS 1
R5_A3          out3 4_A3 R_NOISELESS 10K
R6_A3          out3 MID R_NOISELESS 874.477
C3_A4          4_A4 out4 2.8799e-12
GVCCS4_A4      4_A4 MID out3 MID  -20.7696
R4_A4          4_A4 MID R_NOISELESS 1
R5_A4          out4 4_A4 R_NOISELESS 10K
R6_A4          out4 MID R_NOISELESS 505.8275
C2_A5          out5 MID 1.9175e-15
R3_A5          out5 MID R_NOISELESS 1MEG
GVCCS3_A5      out5 MID out4 MID  -1U
R4_CC         CLAW_CLAMP MID R_NOISELESS 1K
GVCCS4_CC     CLAW_CLAMP MID out5 MID  -1M
R4_CL         CL_CLAMP MID R_NOISELESS 1K
GVCCS4_CL     CL_CLAMP MID CLAW_CLAMP MID  -1M
G_Aol_Zo    Zo_Cleft MID CL_CLAMP ZO_OUT  -89.0464
GVCCS1_1      outz1 MID Zo_Cright MID  -28.8389
C1_1          Zo_Cleft Zo_Cright 1.9201e-07
R2_1          Zo_Cright MID R_NOISELESS 359.2095
R1_1          Zo_Cright Zo_Cleft R_NOISELESS 10K
Rdc_1         Zo_Cleft MID R_NOISELESS 1
GVCCS2_2      outz2 MID net2 MID  -1
C2_2          5_2 MID 3.6378e-12
R5_2          net2 5_2 R_NOISELESS 10K
R4_2          net2 outz1 R_NOISELESS 7600
R7_2          outz1 MID R_NOISELESS 1
R1_3          2_3  MID R_NOISELESS 1
R11_3         5_3  MID R_NOISELESS 0.0285
C4_3          5_3  outz2 1.7684e-13
R10_3         5_3  outz2 R_NOISELESS 10K
XVCVS_LIM_1 5_3  MID MID 2_3   VCCS_LIM_ZO_0_TLC2272
R9_3          outz2 MID R_NOISELESS 1
Rdummy      MID ZO_OUT R_NOISELESS 44700
Rx          ZO_OUT 2_3 R_NOISELESS 447000
.ENDS
*
.SUBCKT VCCS_LIM_ZO_0_TLC2272  VC+ VC- IOUT+ IOUT-
.PARAM GAIN = 350877.6667
.PARAM IPOS = 3297.18e3
.PARAM INEG = -5350.725e3
G1 IOUT+ IOUT- VALUE={LIMIT(GAIN*V(VC+,VC-),INEG,IPOS)}
.ENDS
*
.SUBCKT FEMT_0_TLC2272  1 2
.PARAM NVRF=0.6
.PARAM RNVF={1.184*PWR(NVRF,2)}
E1 3 0 5 0 10
R1 5 0 {RNVF}
R2 5 0 {RNVF}
G1 1 2 3 0 1E-6
.ENDS
*
.SUBCKT VNSE_0_TLC2272  1 2
.PARAM FLW=10
.PARAM NLF=50.597
.PARAM NVR=8.3582
.PARAM GLF={PWR(FLW,0.25)*NLF/1164}
.PARAM RNV={1.184*PWR(NVR,2)}
.MODEL DVN D KF={PWR(FLW,0.5)/1E11} IS=1.0E-16
I1 0 7 10E-3
I2 0 8 10E-3
D1 7 0 DVN
D2 8 0 DVN
E1 3 6 7 8 {GLF}
R1 3 0 1E9
R2 3 0 1E9
R3 3 6 1E9
E2 6 4 5 0 10
R4 5 0 {RNV}
R5 5 0 {RNV}
R6 3 4 1E9
R7 4 0 1E9
E3 1 2 3 4 1
.ENDS
*
.SUBCKT VCCS_LIMIT_IQ_0_TLC2272  VC+ VC- IOUT+ IOUT-
.PARAM GAIN = 1E-3
G1 IOUT- IOUT+ VALUE={IF( (V(VC+,VC-)<=0),0,GAIN*V(VC+,VC-) )}
.ENDS
*
.SUBCKT CLAMP_AMP_LO_0_TLC2272  VC+ VC- VIN COM VO+ VO-
.PARAM G=1
GVO+ COM VO+ VALUE = {IF(V(VIN,COM)>V(VC+,COM),((V(VIN,COM)-V(VC+,COM))*G),0)}
GVO- COM VO- VALUE = {IF(V(VIN,COM)<V(VC-,COM),((V(VC-,COM)-V(VIN,COM))*G),0)}
.ENDS
*
.SUBCKT CLAMP_AMP_HI_0_TLC2272  VC+ VC- VIN COM VO+ VO-
.PARAM G=10
GVO+ COM VO+ VALUE = {IF(V(VIN,COM)>V(VC+,COM),((V(VIN,COM)-V(VC+,COM))*G),0)}
GVO- COM VO- VALUE = {IF(V(VIN,COM)<V(VC-,COM),((V(VC-,COM)-V(VIN,COM))*G),0)}
.ENDS
*
.SUBCKT VCCS_LIM_GR_0_TLC2272  VC+ VC- IOUT+ IOUT-
.PARAM GAIN = 1
.PARAM IPOS = 0.031552e2
.PARAM INEG = -0.031552e2
G1 IOUT+ IOUT- VALUE={LIMIT(GAIN*V(VC+,VC-),INEG,IPOS)}
.ENDS
*
.SUBCKT VCCS_LIM_4_0_TLC2272  VC+ VC- IOUT+ IOUT-
.PARAM GAIN = 1
.PARAM IPOS = 0.1848e2
.PARAM INEG = -0.2268e2
G1 IOUT+ IOUT- VALUE={LIMIT(GAIN*V(VC+,VC-),INEG,IPOS)}
.ENDS
*
.SUBCKT VCCS_LIM_CLAW+_0_TLC2272  VC+ VC- IOUT+ IOUT-
G1 IOUT+ IOUT- TABLE {(V(VC+,VC-))} =
+(0, 13.54e-6)
+(0.940594, 2.28e-4)
+(1.74505, 4.67e-4)
+(2.74752, 8.64e-4)
+(3.00743, 1.04e-3)
+(3.20545,1.35e-3)
+(3.34158, 1.66e-3)
+(3.5396, 2.33e-3)
+(3.65099, 3.16e-3)
+(3.67574, 3.83e-3)
.ENDS
*
.SUBCKT VCCS_LIM_CLAW-_0_TLC2272  VC+ VC- IOUT+ IOUT-
G1 IOUT+ IOUT- TABLE {(V(VC+,VC-))} =
+(0, 13.32e-6)
+(1.9951, 0.00034788)
+(3.9901, 0.00069593)
+(5.3201, 0.00092902)
+(5.3866, 0.00094059)
+(5.5196, 0.00096556)
+(5.6526, 0.0009884)
+(5.7856, 0.0010102)
+(5.9186, 0.001034)
+(5.9852, 0.0010444)
.ENDS
*
.SUBCKT VCCS_LIM_3_0_TLC2272  VC+ VC- IOUT+ IOUT-
.PARAM GAIN = 1
.PARAM IPOS = 0.0924e2
.PARAM INEG = -0.1134e2
G1 IOUT+ IOUT- VALUE={LIMIT(GAIN*V(VC+,VC-),INEG,IPOS)}
.ENDS
*
.SUBCKT OL_SENSE_0_TLC2272  COM SW+ OLN  OLP
GSW+ COM SW+ VALUE = {IF((V(OLN,COM)>10E-3 | V(OLP,COM)>10E-3),1,0)}
.ENDS
*
.SUBCKT VCCS_EXT_LIM_0_TLC2272  VIN+ VIN- IOUT- IOUT+ VP+ VP-
.PARAM GAIN = 1
G1 IOUT+ IOUT- VALUE={LIMIT(GAIN*V(VIN+,VIN-),V(VP-,VIN-), V(VP+,VIN-))}
.ENDS
*
.lib UniversalOpAmp1.lib
.backanno
.end

* Results of the author's LTspice run, read from the files saved beside the schematic
* Operating Point, zero values left out:
*   V(5v) = 5 V
*   V(n002) = 1.115 V
*   V(n004) = 9.14 mV
*   V(n001) = 1.115 V
*   V(vout3) = 1.115 V
*   V(n005) = 1.115 V
*   V(n003) = 1.114 V
*   V(n006) = 2.5 V
*   V(vout1) = 9.14 mV
*   V(vout2) = 1.114 V
*   V(vout4) = 1.115 V
*   Id(J2) = 596.4 pA
*   Ig(J2) = 16.65 pA
*   Is(J2) = -613.1 pA
*   I(V1) = -46.48 pA
*   I(R1) = -31.3 pA
*   Id(J1) = 3.036 nA
*   Ig(J1) = 14.92 pA
*   Is(J1) = -3.051 nA
*   I(R2) = -2.763 nA
*   I(R3) = -310.9 pA
*   Id(J3) = 2.465 nA
*   Ig(J3) = 14.91 pA
*   Is(J3) = -2.48 nA
*   I(R4) = -6.412 pA
*   I(V2) = -2.4 mA
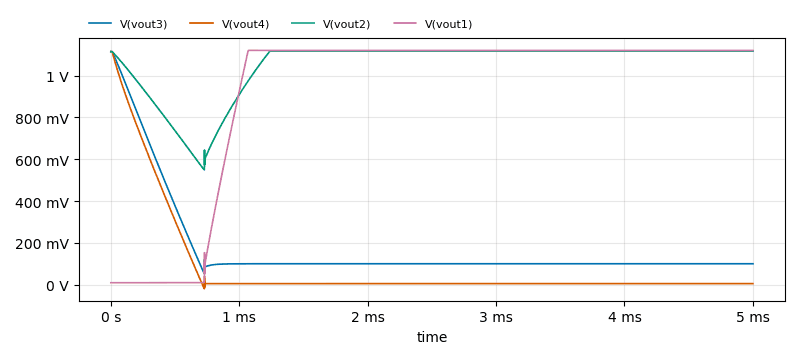
[diagram p4: Transient Analysis of TIA base.asc, plotted from the saved traces]
* Transient Analysis, 1 run:
*   V(vout3): min 52.11 mV, max 1.115 V, average 170.4 mV, rms 269.5 mV, last 99.99 mV
*   V(vout4): min -19.85 mV, max 1.115 V, average 80.22 mV, rms 234.8 mV, last 5.006 mV
*   V(vout2): min 549.2 mV, max 1.118 V, average 1.054 V, rms 1.063 V, last 1.118 V
*   V(vout1): min 9.139 mV, max 1.121 V, average 924.5 mV, rms 1.01 V, last 1.12 V